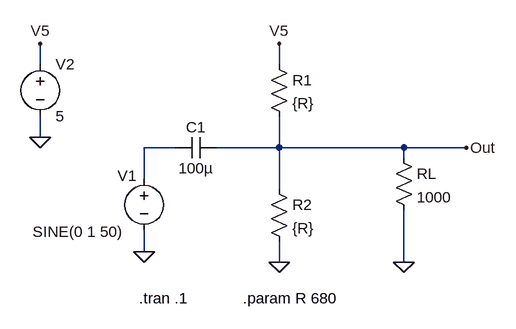
[diagram p0: schematic DCOffset2.asc]
DCOffset2.asc, the LTspice schematic file:
Version 4
SHEET 1 880 680
WIRE 144 -96 144 -128
WIRE 512 -96 512 -128
WIRE 144 16 144 -16
WIRE 352 32 304 32
WIRE 512 32 512 -16
WIRE 512 32 416 32
WIRE 704 32 512 32
WIRE 800 32 704 32
WIRE 704 48 704 32
WIRE 304 80 304 32
WIRE 512 96 512 32
WIRE 304 192 304 160
WIRE 512 208 512 176
WIRE 704 208 704 128
FLAG 304 192 0
FLAG 144 16 0
FLAG 144 -128 V5
FLAG 512 -128 V5
FLAG 512 208 0
FLAG 704 208 0
FLAG 800 32 Out
SYMBOL voltage 304 64 R0
WINDOW 0 -41 11 Left 2
WINDOW 3 -172 97 Left 2
WINDOW 123 0 0 Left 0
WINDOW 39 0 0 Left 0
SYMATTR InstName V1
SYMATTR Value SINE(0 1 50)
SYMBOL voltage 144 -112 R0
WINDOW 123 0 0 Left 0
WINDOW 39 0 0 Left 0
SYMATTR InstName V2
SYMATTR Value 5
SYMBOL cap 416 16 R90
WINDOW 0 0 32 VBottom 2
WINDOW 3 32 32 VTop 2
SYMATTR InstName C1
SYMATTR Value 100µ
SYMBOL res 496 -112 R0
SYMATTR InstName R1
SYMATTR Value {R}
SYMBOL res 496 80 R0
SYMATTR InstName R2
SYMATTR Value {R}
SYMBOL res 688 32 R0
SYMATTR InstName RL
SYMATTR Value 1000
TEXT 296 264 Left 2 !.tran .1
TEXT 456 264 Left 2 !.param R 680

The netlist it stands for:
* DCOffset2.asc
V1 N001 0 SINE(0 1 50)
V2 V5 0 5
C1 Out N001 100µ
R1 V5 Out {R}
R2 Out 0 {R}
RL Out 0 1000
.tran .1
.param R 680
.backanno
.end